# Altium schematic sheet GPIO.SchDoc
size A4; SheetNumber: 6; SheetTotal: 7
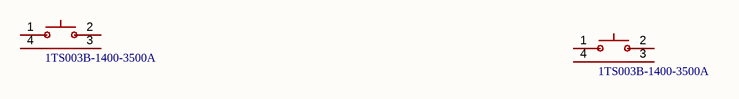
[diagram p0: GPIO.SchDoc]

## Parts
SW?  1TS003B-1400-3500A  [KEY-SMD_1TS003B]
SW??  1TS003B-1400-3500A  [KEY-SMD_1TS003B]

## Nets

Not connected (* = marked no-connect by the designer): SW? 1 2 3 4; SW?? 1 2 3 4

## Library data of the parts
SW? SW?? = 1TS003B-1400-3500A: 4.6*1.82*3.5mm 卧贴 轻触开关; Symbol: 1TS003B-1400-3500A